# Altium schematic sheet NO2-CO Schematic.SchDoc
size D; SheetNumber: 1; SheetTotal: 1; SPICEModelCacheXTSNYQXE: <root> / <DocumentId>XTSNYQXE</DocumentId> / <CacheFrame Number="0"> / <Model Name="umk107bj105_a-t" Kind="CKT"> / <Text>* UMK107BJ105_A-T     SPICE MODEL  ( General Type ) / *-------------------------------------------------------------------------------------------------------- / * Model Generated by TAIYO YUDEN Corporation (http://www.ty-top.com) / * Version 1.0 / * TAIYO YUDEN Control No. 170508_130520 / * Copyright(c) 2012 TAIYO YUDEN CO.,LTD. All Rights Reserved. / *-------------------------------------------------------------------------------------------------------- / * / * Products Name : Multilayer Ceramic Capacitors / * / * Characteristics : / *     Capacitance : 1 uF , Rated Voltage : 50V , TCC : X5R / *     Case Size : 1.6 x 0.8 / 0.063 x 0.031 [mm/inch] , Thickness : 0.8 / 0.031 [mm/inch] / *     (Conditions: Temperature = 25 degC , DC Bias Current/Voltage = 0A / 0V) / * / * Frequency Range : 40Hz - 3GHz / * / * External Node Assignments : / * / *  1  o---| |---o  2 / * / *-------------------------------------------------------------------------------------------------------- / .SubCkt UMK107BJ105_A-T 1 2 / **************************** / C0 1 110 0.79929u / Cm 1 101 0.13681u / C1 101 102 0.26224u / Rc1 101 102 5.8806k / C2 102 103 0.057839u / Rc2 102 103 469.42 / C3 103 110 0.014568u / Rc3 103 110 14.853 / C2m 1 301 0.13283u / C21 301 302 1.2593u / Rc21 301 302 6.3079k / C22 302 303 1.1189u / Rc22 302 303 6.9405k / C23 303 304 1.1421u / Rc23 303 304 6.4848k / C24 304 305 0.36861u / Rc24 304 305 785 / C25 305 306 0.39327u / Rc25 305 306 637.41 / C26 306 307 0.27451u / Rc26 306 307 19.365 / C27 307 308 0.15295u / Rc27 307 308 23.239 / C28 308 309 0.17569u / Rc28 308 309 17.788 / C29 309 110 1420.6p / Rc29 309 110 1.9725 / Rp0 1 110 500Meg / L0 110 120 0.24088n / Lm 120 130 0.1369n / L1 120 121 0.1842n / RL1 121 130 0.29804 / L2 120 122 0.40657n / RL2 122 130 0.57395 / L3 120 123 0.85773n / RL3 123 130 0.82282 / CR 120 124 0.11463u / LR 124 125 0.25983n / RR 125 130 52.447m / CL 130 140 1.4637p / LL 130 140 0.23986n / RL 130 140 33.985 / Rs 140 2 6.8539m / **************************** / .ends UMK107BJ105_A-T</Text> / </Model> / </CacheFrame> / </root>
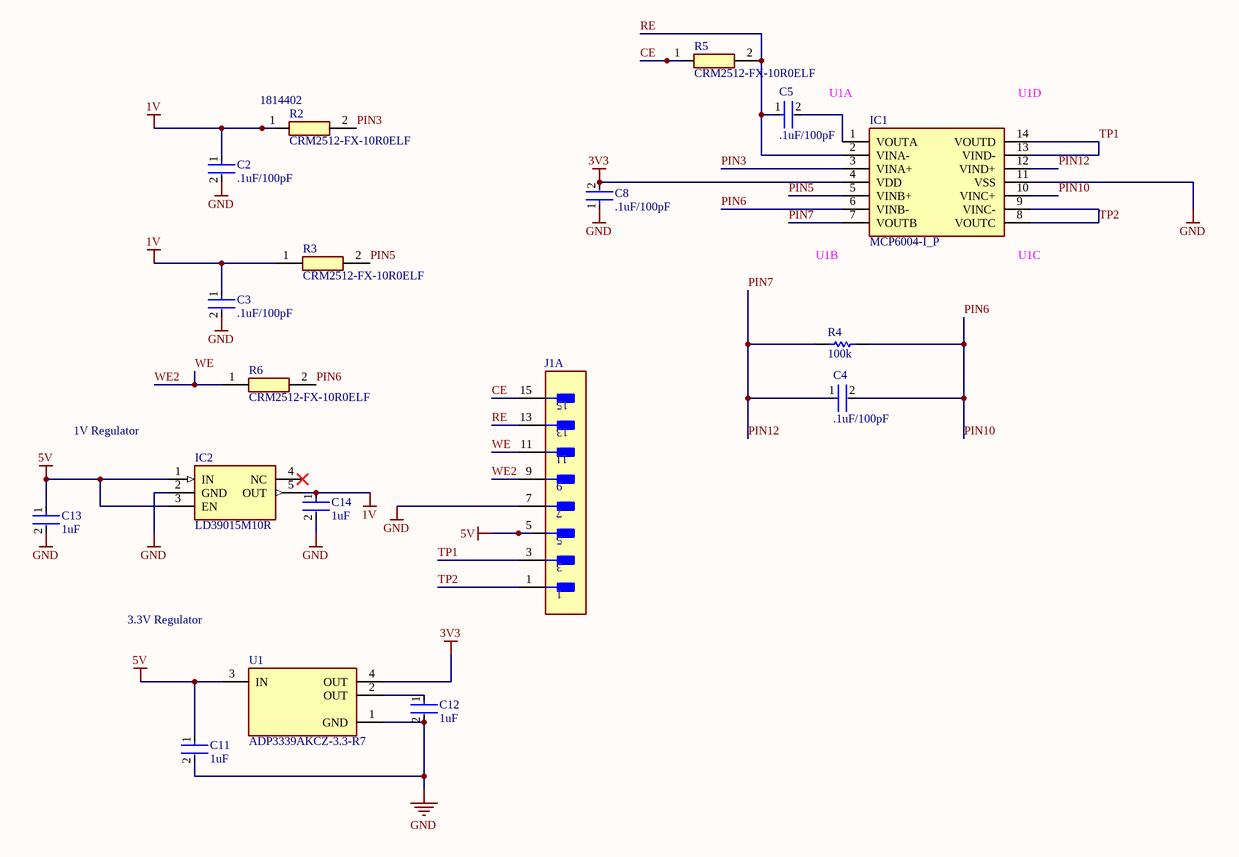
[diagram p0: NO2-CO Schematic.SchDoc]

## Parts
C2  .1uF/100pF  [FP-RCE0DB-MFG]
C3  .1uF/100pF  [FP-RCE0DB-MFG]
C4  .1uF/100pF  [FP-RCE0DB-MFG]
C5  .1uF/100pF  [FP-RCE0DB-MFG]
C8  .1uF/100pF  [FP-RCE0DB-MFG]
C11  1uF  [FP-0603-L_1_6_0_1-W_0_8_0-IPC_B]
C12  1uF  [FP-0603-L_1_6_0_1-W_0_8_0-IPC_B]
C13  1uF  [FP-0603-L_1_6_0_1-W_0_8_0-IPC_B]
C14  1uF  [FP-0603-L_1_6_0_1-W_0_8_0-IPC_B]
IC1  MCP6004-I_P  [DIP794W56P254L1905H432Q14N]
IC2  LD39015M10R  [SOT95P280X145-5N]
J1  (no value)  [FP-87227-8-MFG]  (part A of 2)
R2  CRM2512-FX-10R0ELF  Supplier Part Number 1: 1814402  [RESC6331X80N]
R3  CRM2512-FX-10R0ELF  [RESC6331X80N]
R4  100k  [RESA60-630X240]
R5  CRM2512-FX-10R0ELF  [RESC6331X80N]
R6  CRM2512-FX-10R0ELF  [RESC6331X80N]
U1  ADP3339AKCZ-3.3-R7  [FP-KC-3-IPC_C]

## Nets
1V: C2.1 C3.1 C14.1 IC2.5(OUT) R2.1 R3.1
3V3: C8.2 IC1.4(VDD) U1.4(OUT)
5V: C11.1 C13.1 IC2.1(IN) IC2.3(EN) J1.5 U1.3(IN)
GND: C2.2 C3.2 C8.1 C11.2 C12.2 C13.2 C14.2 IC1.11(VSS) IC2.2(GND) J1.7 U1.1(GND)
CE: J1.15 R5.1
PIN3: IC1.3(VINA+) R2.2
PIN5: IC1.5(VINB+) R3.2
PIN10: C4.2 IC1.6(VINB-) IC1.10(VINC+) R4.2 R6.2  [also labelled PIN6]
PIN12: C4.1 IC1.7(VOUTB) IC1.12(VIND+) R4.1  [also labelled PIN7]
RE: C5.1 IC1.2(VINA-) J1.13 R5.2
TP1: IC1.13(VIND-) IC1.14(VOUTD) J1.3
TP2: IC1.8(VOUTC) IC1.9(VINC-) J1.1
WE: J1.9 J1.11 R6.1  [also labelled WE2]
NetC5_2: C5.2 IC1.1(VOUTA)
NetC12_1: C12.1 U1.2(OUT)

Not connected (* = marked no-connect by the designer): IC2 4(NC)*

## Notes on the sheet
- U1A
- (near IC1) U1D
- (near IC1) U1B
- (near IC1) U1C
- 1V Regulator
- 3.3V Regulator

## Library data of the parts
C2-C5 C8 = CMP-06035-022164-1: Cap Ceramic 100pF 100V C0G ±5% Radial 2.5mm +125°C Ammo Pack; Lead Diameter: 0.5mm; Lead/Base Style: Straight; Resistor Type: Ceramic; Termination: Radial; Voltage Rating: 100V; Height: 3.5mm; Min Operating Temperature: -55°C; Packaging: Tape and Reel; Lead Pitch: 0.098inch; Width: 0.098inch; Voltage Rating (DC): 100V; Tolerance: 5%; Capacitance: 100pF; Max Operating Temperature: 125°C; Dielectric: C0G; Height - Seated (Max): 0.138inch; Case/Package: Radial; Length: 0.142inch; Ratings: AEC-Q200; Mount: Through Hole; Package Quantity: 2000
C11-C14 = CMP-2000-05447-3: None; Tolerance: 10%; Voltage Rating: 50V; Dielectric: X5R; Height: 0.8mm; Depth: 0.8mm; Number of Pins: 2; Length: 1.6mm; Thickness: 0.035inch; Contact Plating: Nickel; Radiation Hardening: No; Package Quantity: 1; Case/Package: 0603; Capacitance: 1uF; Halogen Free: Halogen Free; RoHS Compliant: Yes; Termination: SMD/SMT; Max Operating Temperature: 85°C; Min Operating Temperature: -55°C; Case Code (Metric): 1608; Construction: Flat; Voltage Rating (DC): 50V; Packaging: Tape and Reel; Series: M; Case Code (Imperial): 0603; Width: 0.031inch; Mount: Surface Mount
IC1 = MCP6004-I_P: Integrated Circuit; Manufacturer_Name: Microchip; Manufacturer_Part_Number: MCP6004-I/P; Datasheet Link: http://componentsearchengine.com/Datasheets/1/MCP6004-I_P.pdf; Height: 4.32mm; Mouser Part Number: 579-MCP6004-I/P; Mouser Price/Stock: https://www.mouser.co.uk/ProductDetail/Microchip-Technology-Atmel/MCP6004-I-P?qs=VLwvNDPaIpqIfz2%252Bgie0oA%3D%3D; Arrow Part Number: MCP6004-I/P; Arrow Price/Stock: https://www.arrow.com/en/products/mcp6004-ip/microchip-technology?region=nac
IC2 = LD39015M10R: Integrated Circuit; Manufacturer_Name: STMicroelectronics; Datasheet Link: http://www.st.com/web/en/resource/technical/document/datasheet/CD00173477.pdf; Height: 1.45mm; Manufacturer_Part_Number: LD39015M10R; Mouser Part Number: 511-LD39015M10R; Mouser Price/Stock: https://www.mouser.co.uk/ProductDetail/STMicroelectronics/LD39015M10R?qs=wsLAKTqgg6iLO1LS4XmvbQ%3D%3D; Arrow Part Number: LD39015M10R; Arrow Price/Stock: https://www.arrow.com/en/products/ld39015m10r/stmicroelectronics
J1 = CMP-03369-000064-1: CONN HEADER VERT 16POS 2.54MM; Manufacturer: TE Connectivity; Manufacturer Part Number: 87227-8; Conn Gender: Male; Conn Orientation: Straight; Current Rating: 3A; Number Of Contacts: 16; Mouser Description: Headers & Wire Housings UNSHRD VERT DUAL 16; Lead Free: Yes; Digikey Description: CONN HEADER VERT 16POS 2.54MM; Device Class L3: unset; Automotive: No; Height: 0.428inch; Temperature Range Low: -65°C; Device Class L1: Connectors; RoHS: TRUE; Pitch: 2.54mm; Package: 0; Number Of Rows: 2; Footprint Url: https://www.te.com/commerce/DocumentDelivery/DDEController?Action=showdoc&DocId=Customer+Drawing%7F87227%7FH4%7Fpdf%7FEnglish%7FENG_CD_87227_H4.pdf%7F87227-8; ComponentLink2URL: https://www.te.com/usa-en/product-87227-8.datasheet.pdf; ComponentLink2Description: Datasheet; Temperature: -65°C to +105°C; Category: Conn; Temperature Range High: +105°C; Octopart: https://octopart.com/87227-8-te+connectivity-39407754; Device Class L2: Headers and Wire Housings; Contact Material: Gold,Nickel
R2 R3 R5 R6 = CRM2512-FX-10R0ELF: Resistor; Manufacturer_Name: Bourns; Datasheet Link: http://www.bourns.com/data/global/pdfs/CRM0805_1206_2010.pdf; Height: 0.8mm; Manufacturer_Part_Number: CRM2512-FX-10R0ELF; Mouser Part Number: 652-CRM2512FX10R0ELF; Mouser Price/Stock: https://www.mouser.co.uk/ProductDetail/Bourns/CRM2512-FX-10R0ELF?qs=9fn1gpisni4uwEopCkMdhg%3D%3D; Arrow Part Number: CRM2512-FX-10R0ELF; Arrow Price/Stock: https://www.arrow.com/en/products/crm2512-fx-10r0elf/bourns
  R2: Supplier 1: RSComponents
R4 = CMP-1659-00073-1: Axial Resistor, 100 KOhm, +/- 1%, 0.25 W, -55 to 155 degC, 2-Pin THD, RoHS, Bulk; Voltage Rating: 250 V; Power Rating: 250 mW; Resistance: 475 Ohm; PackageDescription: 2-Pin Axial Lead, Dia 2.4 mm, Body Length 6.3 mm; PackageReference: MFR-25; Length: 0.248 inch; ComponentLink2Description: Datasheet; Packaging: Bulk; DatasheetVersion: Apr-13; Package Quantity: 200; Min Operating Temperature: -55 degC; ComponentLink2URL: http://www.yageo.com/documents/recent/Yageo%20LR_MFR_2013.pdf; RoHSCompliant: true; ComponentLink1URL: http://www.yageo.com/; Tolerance: 1%; Case\Package: Axial; Mount: Through Hole; ComponentLink1Description: Manufacturer URL; Max Operating Temperature: 155 degC
U1 = CMP-0786-00156-2: IC REG LINEAR 3.3V 1.5A SOT223-3; Number of Outputs: 1; Output Voltage Accuracy: 0.9%; Max Input Voltage: 6V; Max Supply Current: 40mA; Min Input Voltage: 2.8V; Min Output Voltage: 1.5V; Polarity: Positive; Quiescent Current: 130uA; Dropout Voltage: 230mV; Power Supply Rejection Ratio (PSRR): 88dB; Max Output Voltage: 5V; Output Type: Fixed; Min Operating Temperature: -40°C; Package Quantity: 500; Max Output Current: 1.5A; Max Operating Temperature: 85°C; Number of Regulators: 1; Height: 1.6mm; Accuracy: 0.9%; Case/Package: SOT-223; Number of Pins: 3; Operating Supply Current: 40mA; Nominal Output Voltage: 3.3V; Lead Free: Contains Lead; Output Voltage: 3.3V; Packaging: Tape and Reel; REACH SVHC: No SVHC; Output Current: 1.5A; Width: 3.5mm; Length: 6.5mm; Radiation Hardening: No